# Altium schematic sheet EMG-circuit_v2.SchDoc
size A3; SheetNumber: 1; SheetTotal: 1; SPICEModelCacheHVKWMQRZ: <root> / <DocumentId>HVKWMQRZ</DocumentId> / <CacheFrame Number="0"> / <Model Name="cap" Kind="MDL"> / <Text>*Default semiconductor capacitor / .MODEL CAP C()</Text> / </Model> / </CacheFrame> / </root>
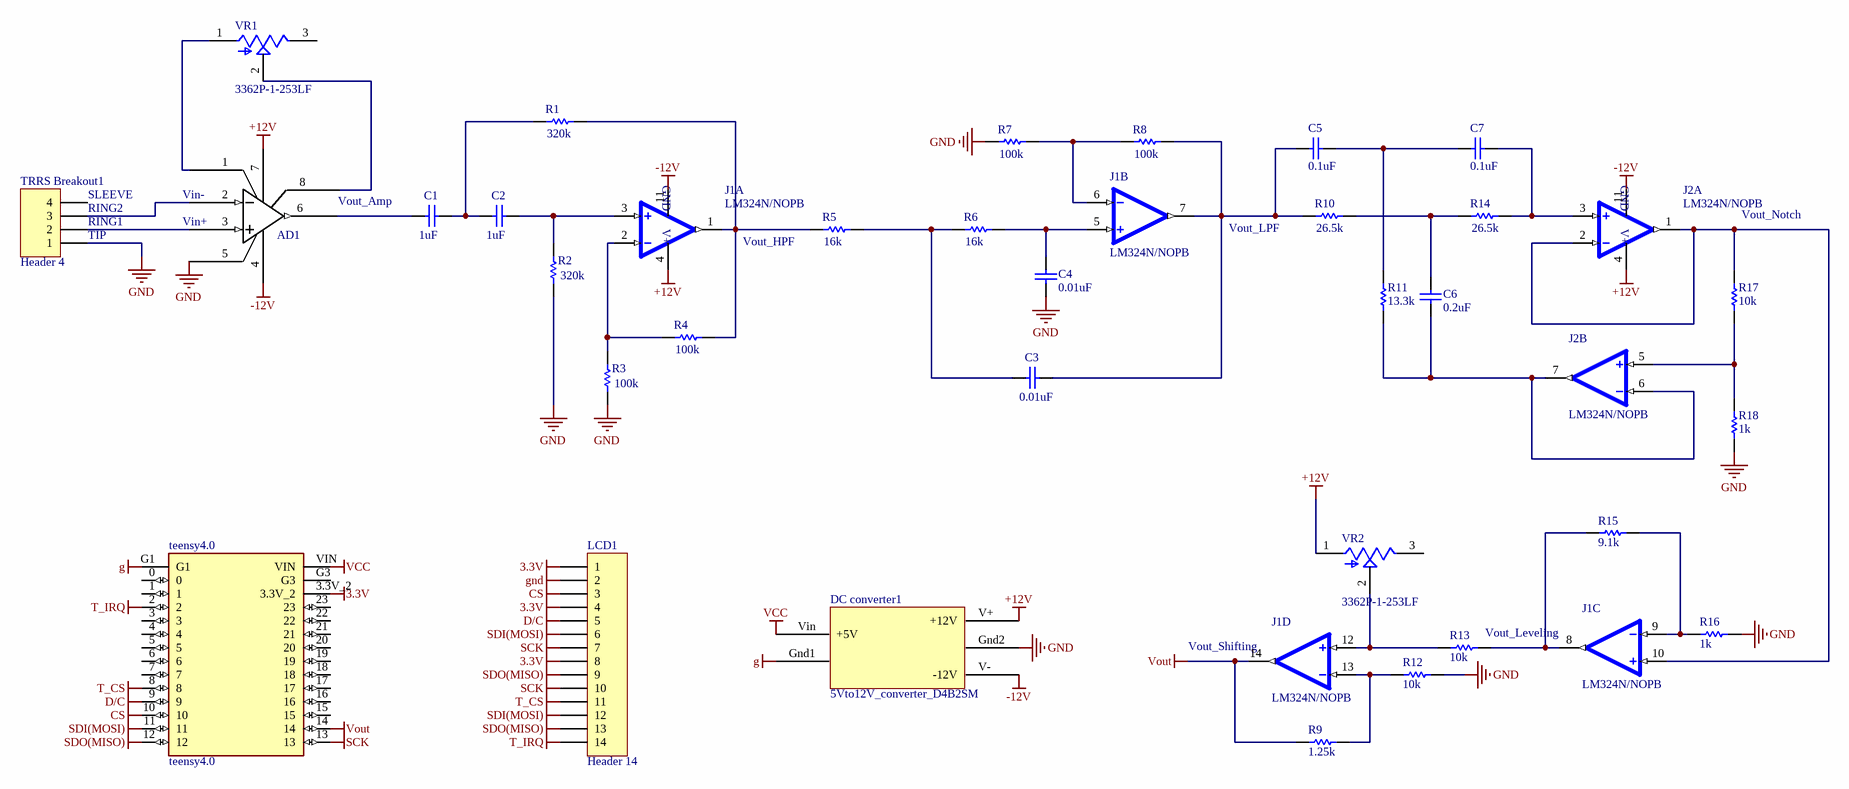
[diagram p0: EMG-circuit_v2.SchDoc]

## Parts
AD1  [Instrumentation amplifier]8pin-DIP-10.92*7.11  [AD620AN-8pin-10.92*7.11]  (value not drawn)
C1  value 1uF  [RAD-0.3]  (hidden comment: Cap)
C2  value 1uF  [RAD-0.3]  (hidden comment: Cap)
C3  value 0.01uF  [RAD-0.3]  (hidden comment: Cap)
C4  value 0.01uF  [RAD-0.3]  (hidden comment: Cap)
C5  value 0.1uF  [RAD-0.3]  (hidden comment: Cap)
C6  value 0.2uF  [RAD-0.3]  (hidden comment: Cap)
C7  value 0.1uF  [RAD-0.3]  (hidden comment: Cap)
DC_converter1  5Vto12V_converter_D4B2SM  [5Vto12V_converter-5pin-24*12.4]
J1  LM324N/NOPB  [DIP825W47P254L1917H533Q14]  (parts A,B,C,D of 4)
J2  LM324N/NOPB  [DIP825W47P254L1917H533Q14]  (parts A,B of 4)
LCD1  Header 14  [HDR1X14]
R1  value 320k  [AXIAL-0.3]  (hidden comment: Res1)
R2  value 320k  [AXIAL-0.3]  (hidden comment: Res1)
R3  value 100k  [AXIAL-0.3]  (hidden comment: Res1)
R4  value 100k  [AXIAL-0.3]  (hidden comment: Res1)
R5  value 16k  [AXIAL-0.3]  (hidden comment: Res1)
R6  value 16k  [AXIAL-0.3]  (hidden comment: Res1)
R7  value 100k  [AXIAL-0.3]  (hidden comment: Res1)
R8  value 100k  [AXIAL-0.3]  (hidden comment: Res1)
R9  value 1.25k  [AXIAL-0.3]  (hidden comment: Res1)
R10  value 26.5k  [AXIAL-0.3]  (hidden comment: Res1)
R11  value 13.3k  [AXIAL-0.3]  (hidden comment: Res1)
R12  value 10k  [AXIAL-0.3]  (hidden comment: Res1)
R13  value 10k  [AXIAL-0.3]  (hidden comment: Res1)
R14  value 26.5k  [AXIAL-0.3]  (hidden comment: Res1)
R15  value 9.1k  [AXIAL-0.3]  (hidden comment: Res1)
R16  value 1k  [AXIAL-0.3]  (hidden comment: Res1)
R17  value 10k  [AXIAL-0.3]  (hidden comment: Res1)
R18  value 1k  [AXIAL-0.3]  (hidden comment: Res1)
teensy4.0  teensy4.0  [teensy4.0]
TRRS_Breakout1  Header 4  [HDR1X4]
VR1  3362P-1-253LF  [TRIM_3362P-1-253LF]
VR2  3362P-1-253LF  [TRIM_3362P-1-253LF]

## Nets
3.3V: LCD1.1 LCD1.4 LCD1.8 teensy4.0.3.3V_2
+12V: AD1.7(+Vs) DC_converter1.V+(+12V) J1.4(V+) J2.4(V+) VR2.1(CCW)
-12V: AD1.4(-Vs) DC_converter1.V-(-12V) J1.11(GND) J2.11(GND)
CS: LCD1.3 teensy4.0.10
D/C: LCD1.5 teensy4.0.9
g: DC_converter1.Gnd1(gnd1) teensy4.0.G1
GND: AD1.5(Ref) C4.2 DC_converter1.Gnd2(gnd) LCD1.2 R2.1 R3.2 R7.1 R12.1 R16.1 R18.1 TRRS_Breakout1.1
SCK: LCD1.7 LCD1.10 teensy4.0.13
SDI(MOSI): LCD1.6 LCD1.12 teensy4.0.11
SDO(MISO): LCD1.9 LCD1.13 teensy4.0.12
T_CS: LCD1.11 teensy4.0.8
T_IRQ: LCD1.14 teensy4.0.2
VCC: DC_converter1.Vin(+5V) teensy4.0.VIN
Vout: J1.14(4OUT) R9.2 teensy4.0.14
NetAD1_1: AD1.1(Rg) VR1.1(CCW)
NetAD1_2: AD1.2(Vin-) TRRS_Breakout1.3
NetAD1_3: AD1.3(Vin+) TRRS_Breakout1.2
NetAD1_6: AD1.6(Output) C1.1
NetAD1_8: AD1.8(Rg) VR1.2(WIPER)
NetC1_2: C1.2 C2.1 R1.2
NetC2_2: C2.2 J1.3(1IN+) R2.2
NetC3_1: C3.1 R5.2 R6.1
NetC3_2: C3.2 C5.2 J1.7(2OUT) R8.2 R10.1
NetC4_1: C4.1 J1.5(2IN+) R6.2
NetC5_1: C5.1 C7.2 R11.2
NetC6_1: C6.1 J2.6(2IN-) J2.7(2OUT) R11.1
NetC6_2: C6.2 R10.2 R14.1
NetC7_1: C7.1 J2.3(1IN+) R14.2
NetJ1_1: J1.1(1OUT) R1.1 R4.2 R5.1
NetJ1_2: J1.2(1IN-) R3.1 R4.1
NetJ1_6: J1.6(2IN-) R7.2 R8.1
NetJ1_8: J1.8(3OUT) R13.1 R15.2
NetJ1_9: J1.9(3IN-) R15.1 R16.2
NetJ1_10: J1.10(3IN+) J2.1(1OUT) J2.2(1IN-) R17.2
NetJ1_12: J1.12(4IN+) R13.2 VR2.2(WIPER)
NetJ1_13: J1.13(4IN-) R9.1 R12.2
NetJ2_5: J2.5(2IN+) R17.1 R18.2

Not connected (* = marked no-connect by the designer): teensy4.0 0 1 3 4 5 6 7 15 16 17 18 19 20 21 22 23 G3; TRRS_Breakout1 4; VR1 3(CW); VR2 3(CW)

## Notes on the sheet
- (near TRRS_Breakout1) TIP
- (near TRRS_Breakout1) RING1
- (near TRRS_Breakout1) RING2
- (near TRRS_Breakout1) SLEEVE
- (near AD1) Vin+
- (near AD1) Vin-
- Vout_Amp
- Vout_HPF
- Vout_LPF
- Vout_Notch
- (near J1) Vout_Shifting
- (near R13) Vout_Leveling

## Library data of the parts
AD1 = OP
C1-C7 = Cap: Capacitor; Published: 8-Jun-2000; LatestRevisionDate: 17-Jul-2002; LatestRevisionNote: Re-released for DXP Platform.; PackageReference: RAD-0.3; Publisher: Altium Limited; PackageDescription: Radial Cap, Thru-Hole; 2 Leads; 0.3 in Pin Spacing
DC_converter1 = 5Vto12V_converter_D4B2SM: 5V to +-12V DC converter
LCD1 = Header 14: Header, 14-Pin; LatestRevisionDate: 17-Jul-2002; LatestRevisionNote: Re-released for DXP Platform.; Publisher: Altium Limited
R1-R18 = Res1: Resistor; Published: 8-Jun-2000; LatestRevisionDate: 17-Jul-2002; LatestRevisionNote: Re-released for DXP Platform.; PackageReference: AXIAL-0.3; Publisher: Altium Limited; PackageDescription: Axial Device, Thru-Hole; 2 Leads; 0.3 in Pin Spacing
TRRS_Breakout1 = Header 4: Header, 4-Pin; LatestRevisionDate: 17-Jul-2002; LatestRevisionNote: Re-released for DXP Platform.; Publisher: Altium Limited
VR1 VR2 = 3362P-1-253LF: 25 kOhms 0.5W, 1/2W PC Pins Through Hole Trimmer Potentiometer Cermet 1 Turn Top Adjustment; MF: Bourns; Check_prices: https://www.snapeda.com/parts/3362P-1-253LF/Bourns/view-part/493663/?ref=eda; SnapEDA_Link: https://www.snapeda.com/parts/3362P-1-253LF/Bourns/view-part/493663/?ref=snap; Availability: Good; Value: *; Purchase-URL: https://pricing.snapeda.com/search/part/3362P-1-253LF/?ref=eda; Price: None; MP: 3362P-1-253LF; Package: 3116 Bourns
J1 J2 = LM324N/NOPB: Price: None; Package: None; Availability: Unavailable; MP: LM324N/NOPB; Value: *